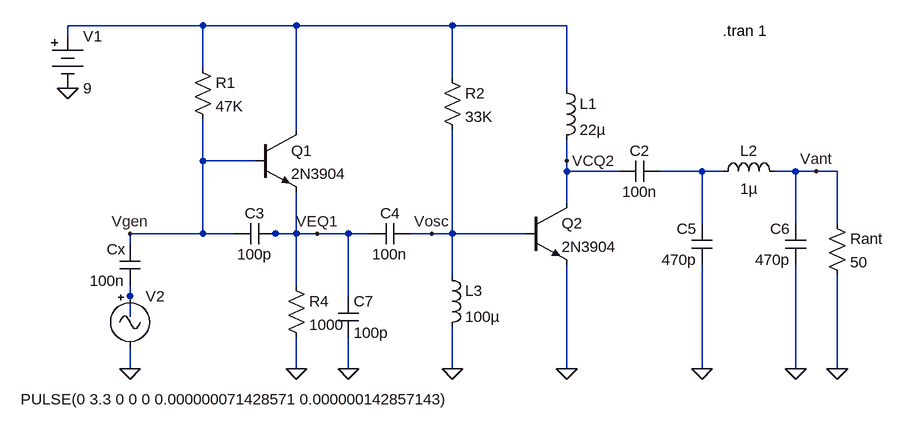
[diagram p0: schematic LTSpice_PixiePico_TX_Design.asc]
LTSpice_PixiePico_TX_Design.asc, the LTspice schematic file:
Version 4
SHEET 1 1144 680
WIRE 96 32 -112 32
WIRE 240 32 96 32
WIRE 480 32 240 32
WIRE 656 32 480 32
WIRE -112 48 -112 32
WIRE 96 96 96 32
WIRE 480 112 480 32
WIRE 656 128 656 32
WIRE 240 192 240 32
WIRE 96 240 96 176
WIRE 176 240 96 240
WIRE 656 240 656 208
WIRE 656 256 656 240
WIRE 736 256 656 256
WIRE 864 256 800 256
WIRE 896 256 864 256
WIRE 1008 256 976 256
WIRE 1040 256 1008 256
WIRE 1072 256 1040 256
WIRE 656 304 656 256
WIRE 864 336 864 256
WIRE 1008 336 1008 256
WIRE 1072 336 1072 256
WIRE 96 352 96 240
WIRE 96 352 -16 352
WIRE 144 352 96 352
WIRE 208 352 192 352
WIRE 240 352 240 288
WIRE 240 352 208 352
WIRE 272 352 240 352
WIRE 320 352 272 352
WIRE 352 352 320 352
WIRE 448 352 416 352
WIRE 480 352 480 192
WIRE 480 352 448 352
WIRE 592 352 480 352
WIRE -16 368 -16 352
WIRE 480 416 480 352
WIRE 240 432 240 352
WIRE -16 448 -16 432
WIRE 320 448 320 352
WIRE -16 480 -16 448
WIRE -16 560 -16 528
WIRE 240 560 240 512
WIRE 320 560 320 512
WIRE 480 560 480 496
WIRE 656 560 656 400
WIRE 864 560 864 400
WIRE 1008 560 1008 400
WIRE 1072 560 1072 416
FLAG -112 128 0
FLAG 240 560 0
FLAG 320 560 0
FLAG -16 560 0
FLAG 480 560 0
FLAG 656 560 0
FLAG 864 560 0
FLAG 1008 560 0
FLAG 1072 560 0
FLAG 1040 256 Vant
FLAG -16 352 Vgen
FLAG 448 352 Vosc
FLAG 656 240 VCQ2
FLAG 272 352 VEQ1
SYMBOL npn 176 192 R0
SYMATTR InstName Q1
SYMATTR Value 2N3904
SYMBOL npn 592 304 R0
SYMATTR InstName Q2
SYMATTR Value 2N3904
SYMBOL Res 80 80 R0
SYMATTR InstName R1
SYMATTR Value 47K
SYMBOL Misc/battery -112 32 R0
SYMATTR InstName V1
SYMATTR Value 9
SYMBOL Res 224 416 R0
SYMATTR InstName R4
SYMATTR Value 1000
SYMBOL Cap 416 336 R90
WINDOW 0 0 32 VBottom 2
WINDOW 3 32 32 VTop 2
SYMATTR InstName C4
SYMATTR Value 100n
SYMBOL Misc/signal -16 432 R0
WINDOW 3 -168 175 Left 2
SYMATTR InstName V2
SYMATTR Value PULSE(0 3.3 0 0 0 0.000000071428571 0.000000142857143)
SYMBOL Cap 0 432 R180
WINDOW 0 37 56 Center 2
WINDOW 3 24 8 Left 2
SYMATTR InstName Cx
SYMATTR Value 100n
SYMBOL Res 464 96 R0
SYMATTR InstName R2
SYMATTR Value 33K
SYMBOL ind 464 400 R0
SYMATTR InstName L3
SYMATTR Value 100µ
SYMBOL ind 640 112 R0
SYMATTR InstName L1
SYMATTR Value 22µ
SYMBOL Cap 800 240 R90
WINDOW 0 0 32 VBottom 2
WINDOW 3 32 32 VTop 2
SYMATTR InstName C2
SYMATTR Value 100n
SYMBOL Cap 880 400 R180
WINDOW 0 24 56 Left 2
WINDOW 3 24 8 Left 2
SYMATTR InstName C5
SYMATTR Value 470p
SYMBOL Cap 1024 400 R180
WINDOW 0 24 56 Left 2
WINDOW 3 24 8 Left 2
SYMATTR InstName C6
SYMATTR Value 470p
SYMBOL ind 880 272 R270
WINDOW 0 32 56 VTop 2
WINDOW 3 5 56 VBottom 2
SYMATTR InstName L2
SYMATTR Value 1µ
SYMBOL Res 1056 320 R0
SYMATTR InstName Rant
SYMATTR Value 50
SYMBOL cap 208 336 R90
WINDOW 0 0 32 VBottom 2
WINDOW 3 32 32 VTop 2
SYMATTR InstName C3
SYMATTR Value 100p
SYMBOL cap 304 448 R0
SYMATTR InstName C7
SYMATTR Value 100p
TEXT 896 40 Left 2 !.tran 1

The netlist it stands for:
* LTSpice_PixiePico_TX_Design.asc
Q1 N001 Vgen VEQ1 0 2N3904
Q2 VCQ2 Vosc 0 0 2N3904
R1 N001 Vgen 47K
V1 N001 0 9
R4 VEQ1 0 1000
C4 Vosc VEQ1 100n
V2 N003 0 PULSE(0 3.3 0 0 0 0.000000071428571 0.000000142857143)
Cx N003 Vgen 100n
R2 N001 Vosc 33K
L3 Vosc 0 100µ
L1 N001 VCQ2 22µ
C2 N002 VCQ2 100n
C5 0 N002 470p
C6 0 Vant 470p
L2 N002 Vant 1µ
Rant Vant 0 50
C3 VEQ1 Vgen 100p
C7 VEQ1 0 100p
.model NPN NPN
.model PNP PNP
.lib standard.bjt
.tran 1
.backanno
.end